# Altium schematic sheet POWER.SchDoc: Network Module
size 431 x 279 mm; DrawnBy: Bin Xiao; Organization: RYSE Inc.
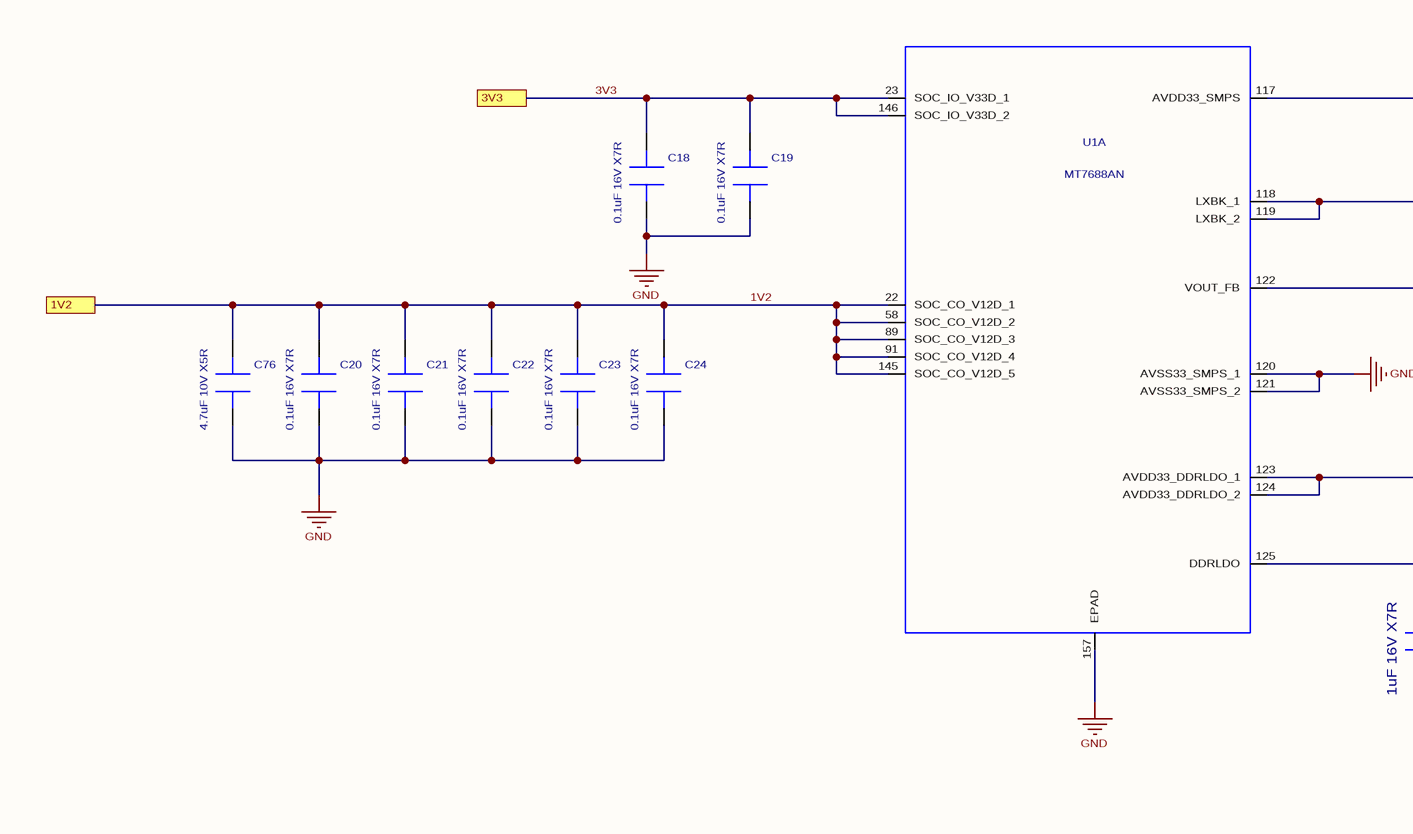
[diagram p0: POWER.SchDoc, left]
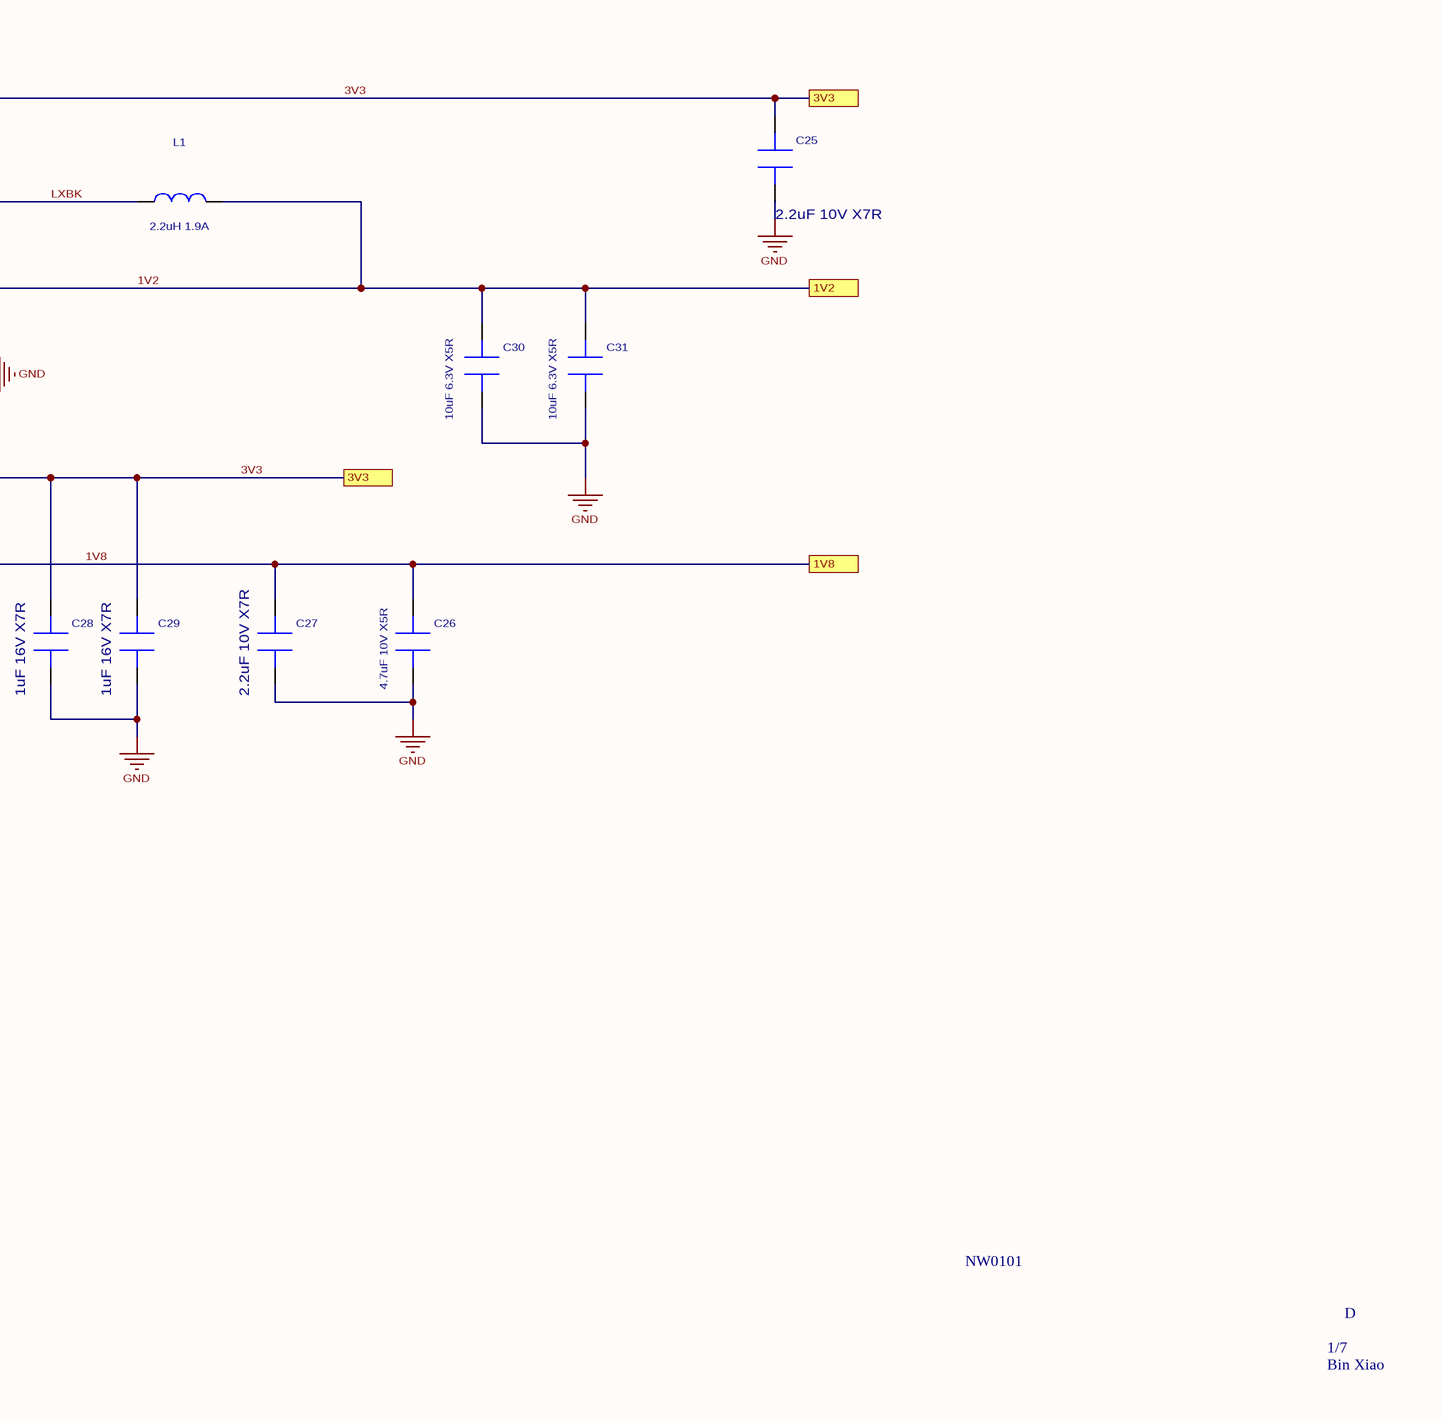
[diagram p1: POWER.SchDoc, right]

## Parts
C18  value 0.1uF 16V X7R  [C0201]  (hidden comment: CAP0201-104-16V-X7R)
C19  value 0.1uF 16V X7R  [C0201]  (hidden comment: CAP0201-104-16V-X7R)
C20  value 0.1uF 16V X7R  [C0201]  (hidden comment: CAP0201-104-16V-X7R)
C21  value 0.1uF 16V X7R  [C0201]  (hidden comment: CAP0201-104-16V-X7R)
C22  value 0.1uF 16V X7R  [C0201]  (hidden comment: CAP0201-104-16V-X7R)
C23  value 0.1uF 16V X7R  [C0201]  (hidden comment: CAP0201-104-16V-X7R)
C24  value 0.1uF 16V X7R  [C0201]  (hidden comment: CAP0201-104-16V-X7R)
C25  value 2.2uF 10V X7R  [C0402]  (hidden comment: CAP0402-225-6.3V-X7R)
C26  value 4.7uF 10V X5R  [C0402]  (hidden comment: CAP0402-475-10V-X5R)
C27  value 2.2uF 10V X7R  [C0402]  (hidden comment: CAP0402-225-6.3V-X7R)
C28  value 1uF 16V X7R  [C0402]  (hidden comment: CAP0402-105-6.3V-X7R)
C29  value 1uF 16V X7R  [C0402]  (hidden comment: CAP0402-105-6.3V-X7R)
C30  value 10uF 6.3V X5R  [C0402]  (hidden comment: CAP0402-106-6.3V-X5R)
C31  value 10uF 6.3V X5R  [C0402]  (hidden comment: CAP0402-106-6.3V-X5R)
C76  value 4.7uF 10V X5R  [C0402]  (hidden comment: CAP0402-475-10V-X5R)
L1  value 2.2uH 1.9A  [L0805]  (hidden comment: IND0805_2.2U_1.9A)
U1  MT7688AN  [DR-QFN-128]  (part A of 6)

## Ports
1V2, 1V8, 3V3

## Nets
GND: C18.2 C19.2 C20.2 C21.2 C22.2 C23.2 C24.2 C25.2 C26.2 C27.2 C28.2 C29.2 C30.2 C31.2 C76.2 U1.120(AVSS33_SMPS_1) U1.121(AVSS33_SMPS_2) U1.157(EPAD)
1V2: C20.1 C21.1 C22.1 C23.1 C24.1 C30.1 C31.1 C76.1 L1.2 U1.22(SOC_CO_V12D_1) U1.58(SOC_CO_V12D_2) U1.89(SOC_CO_V12D_3) U1.91(SOC_CO_V12D_4) U1.122(VOUT_FB) U1.145(SOC_CO_V12D_5) ; port 1V2
1V8: C26.1 C27.1 U1.125(DDRLDO) ; port 1V8
3V3: C18.1 C19.1 C25.1 C28.1 C29.1 U1.23(SOC_IO_V33D_1) U1.117(AVDD33_SMPS) U1.123(AVDD33_DDRLDO_1) U1.124(AVDD33_DDRLDO_2) U1.146(SOC_IO_V33D_2) ; port 3V3
LXBK: L1.1 U1.118(LXBK_1) U1.119(LXBK_2)

## Notes on the sheet
- NW0101
- 1/7
- D
- Bin Xiao

## Library data of the parts
C18-C24 = CAP0201-104-16V-X7R: CAP CER 0.1UF 16V X7R 0201; Part Number: GRM033Z71C104KE14D; Manufacturer: Murata Electronics; Prefered Vender: Digikey; Aligni Value: 0.1u; Type: Capacitor; Geometry.Height: 0.33mm; PCB DECAL: RC0201; Revision: A
C25 C27 = CAP0402-225-6.3V-X7R: CAP CER 2.2UF 10V X7R 0402; Part Number: GRM155Z71A225KE01D; Manufacturer: Murata Electronics; Prefered Vender: Digikey; Aligni Value: 2.2u; Type: Capacitor; Geometry.Height: 0.33mm; PCB DECAL: RC0402; Revision: A
C26 C76 = CAP0402-475-10V-X5R: CAP CER 4.7UF 10V X5R 0402; Part Number: CL05A475MP5NRNC; Manufacturer: Samsung Electro-Mechanics; Prefered Vender: Digikey; Aligni Value: 4.7u; Type: Capacitor; Geometry.Height: 0.33mm; PCB DECAL: RC0402; Revision: A
C28 C29 = CAP0402-105-6.3V-X7R: CAP CER 1UF 6.3V X7R 0402; Part Number: GRM155R70J105KA12D; Manufacturer: Murata Electronics; Prefered Vender: Digikey; Aligni Value: 1u; Type: Capacitor; Geometry.Height: 0.33mm; PCB DECAL: RC0402; Revision: A
C30 C31 = CAP0402-106-6.3V-X5R: CAP CER 10UF 6.3V X5R 0402; Part Number: GRM155R60J106ME05J; Manufacturer: Murata Electronics; Prefered Vender: Digikey; Aligni Value: 10u; Type: Capacitor; Geometry.Height: 0.33mm; Revision: A; PCB DECAL: C0402
L1 = IND0805_2.2U_1.9A: POWER CHOKE MOLDED 2.2UH 1.9A; Part Number: WLPH201610M2R2PP; Manufacturer: Walsin Technology Corporation; Prefered Vender: Digikey; Geometry.Height: 1.5mm; Aligni Value: 2.2u; Type: Inductor; PCB DECAL: RC0805; Revision: A
U1 = MT7688AN: 580Mhz 32bits Networking Processor; Manufacturer: MediaTek Inc; Geometry.Height: 0mm; Type: IC; Part Number: MT7688AN; PCB DECAL: DR-QFN-128